# EAGLE schematic QTTSCH01V01 v2 (EAGLE 9.7.0)
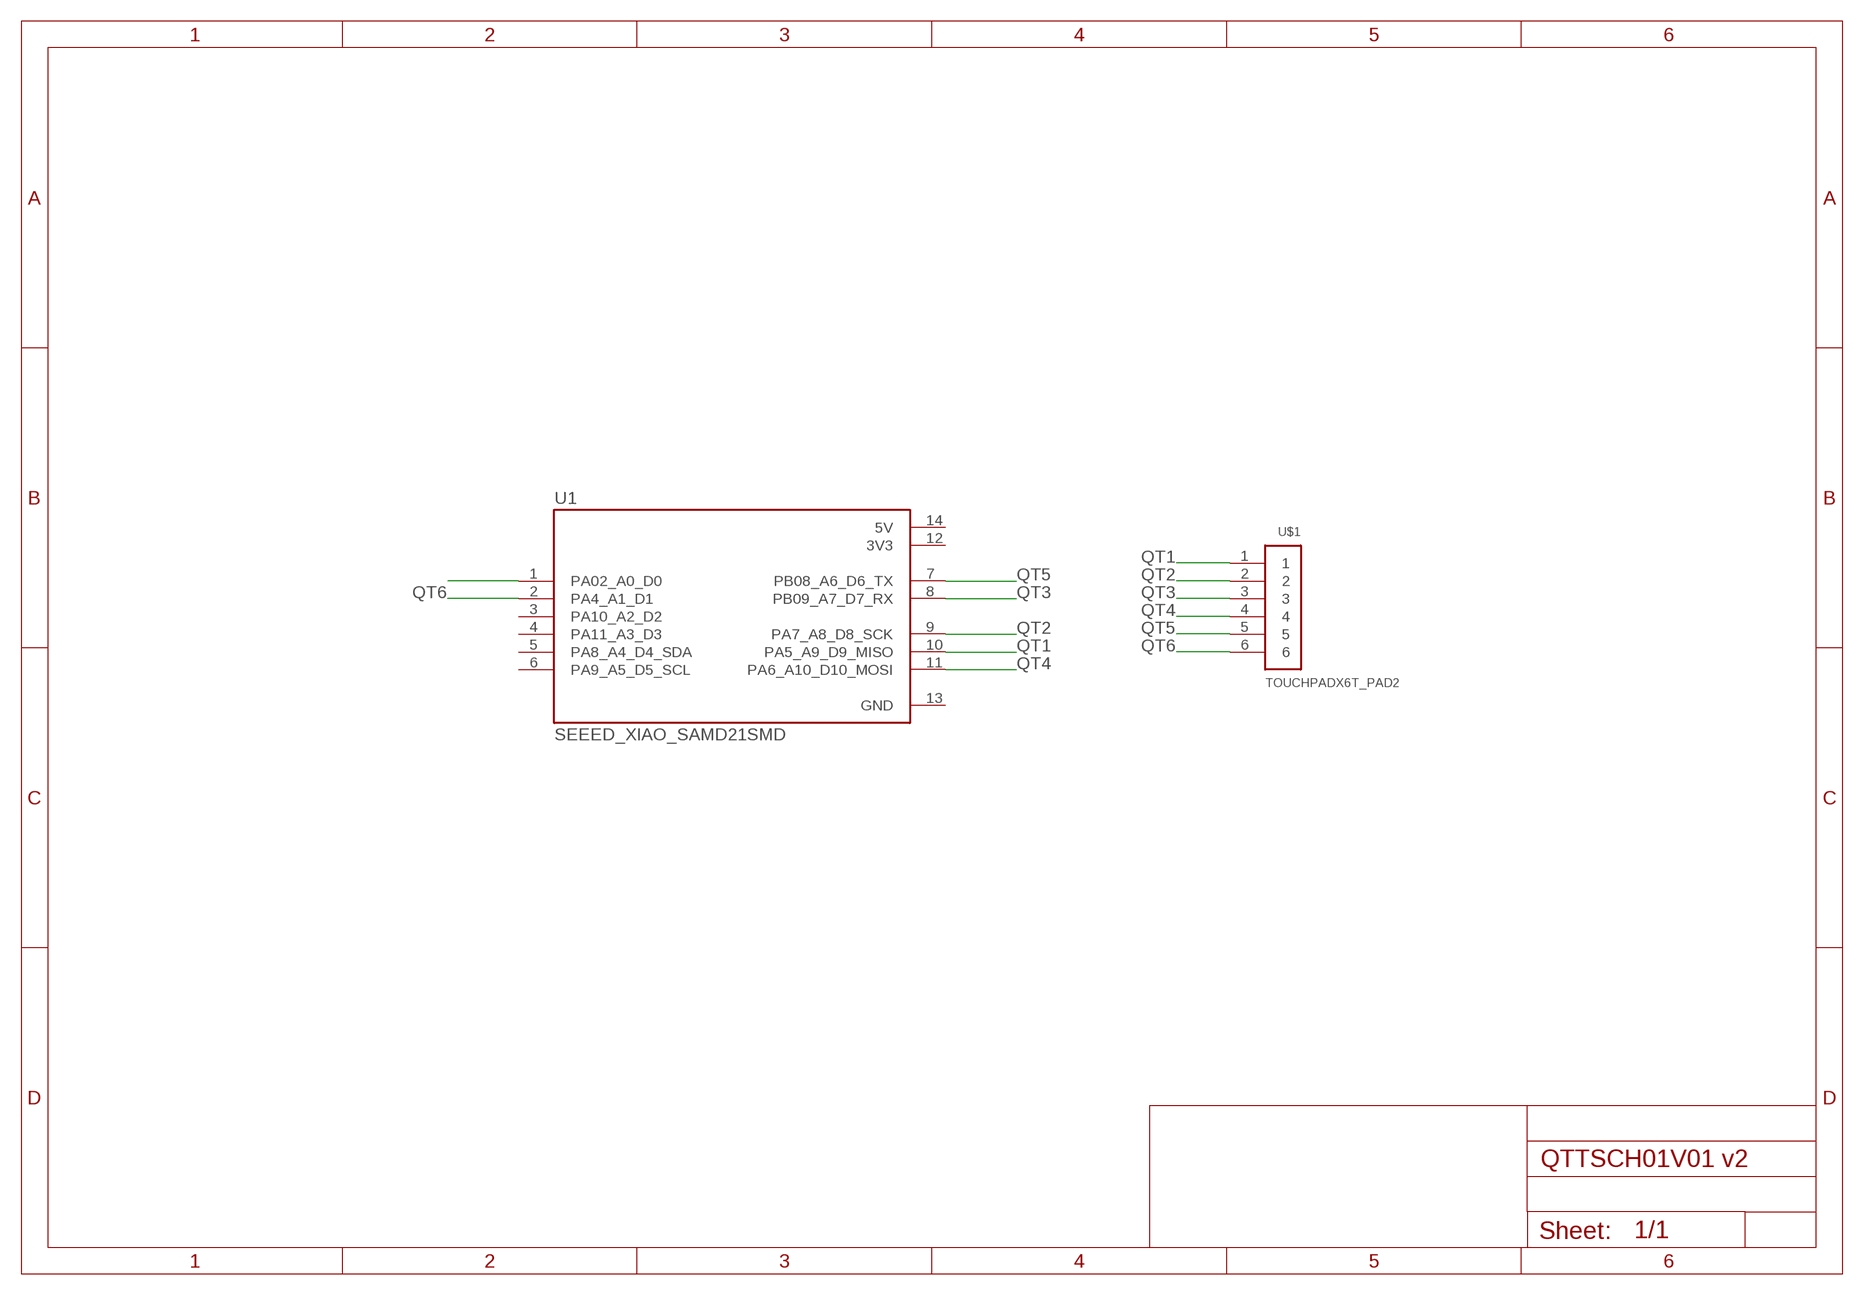
[diagram p0: schematic, sheet 1]

## Parts
U1  SEEED_XIAO_SAMD21SMD  [MODULE_SAMD21_SMD]
U$1  TOUCHPADX6T_PAD2  [TOUCHPADX6A]

## Nets
N$1: U1.1(PA02_A0_D0)
QT1: U1.10(PA5_A9_D9_MISO) U$1.1
QT2: U1.9(PA7_A8_D8_SCK) U$1.2
QT3: U1.8(PB09_A7_D7_RX) U$1.3
QT4: U1.11(PA6_A10_D10_MOSI) U$1.4
QT5: U1.7(PB08_A6_D6_TX) U$1.5
QT6: U1.2(PA4_A1_D1) U$1.6
Unconnected: U1.3(PA10_A2_D2) U1.4(PA11_A3_D3) U1.5(PA8_A4_D4_SDA) U1.6(PA9_A5_D5_SCL)

## Power pins joined to a net without a drawn wire
3V3: U1.12(3V3)
5V: U1.14(5V)
GND: U1.13(GND)

## Library data of the parts
U1 = PENNEDS:SEEED_XIAO_SAMD21: Check availability <https://pricing.snapeda.com/parts/102010388/seeed%20technology%20limited/view-part?ref=eda>
U$1 = PENNEDS:TOUCHPADX6